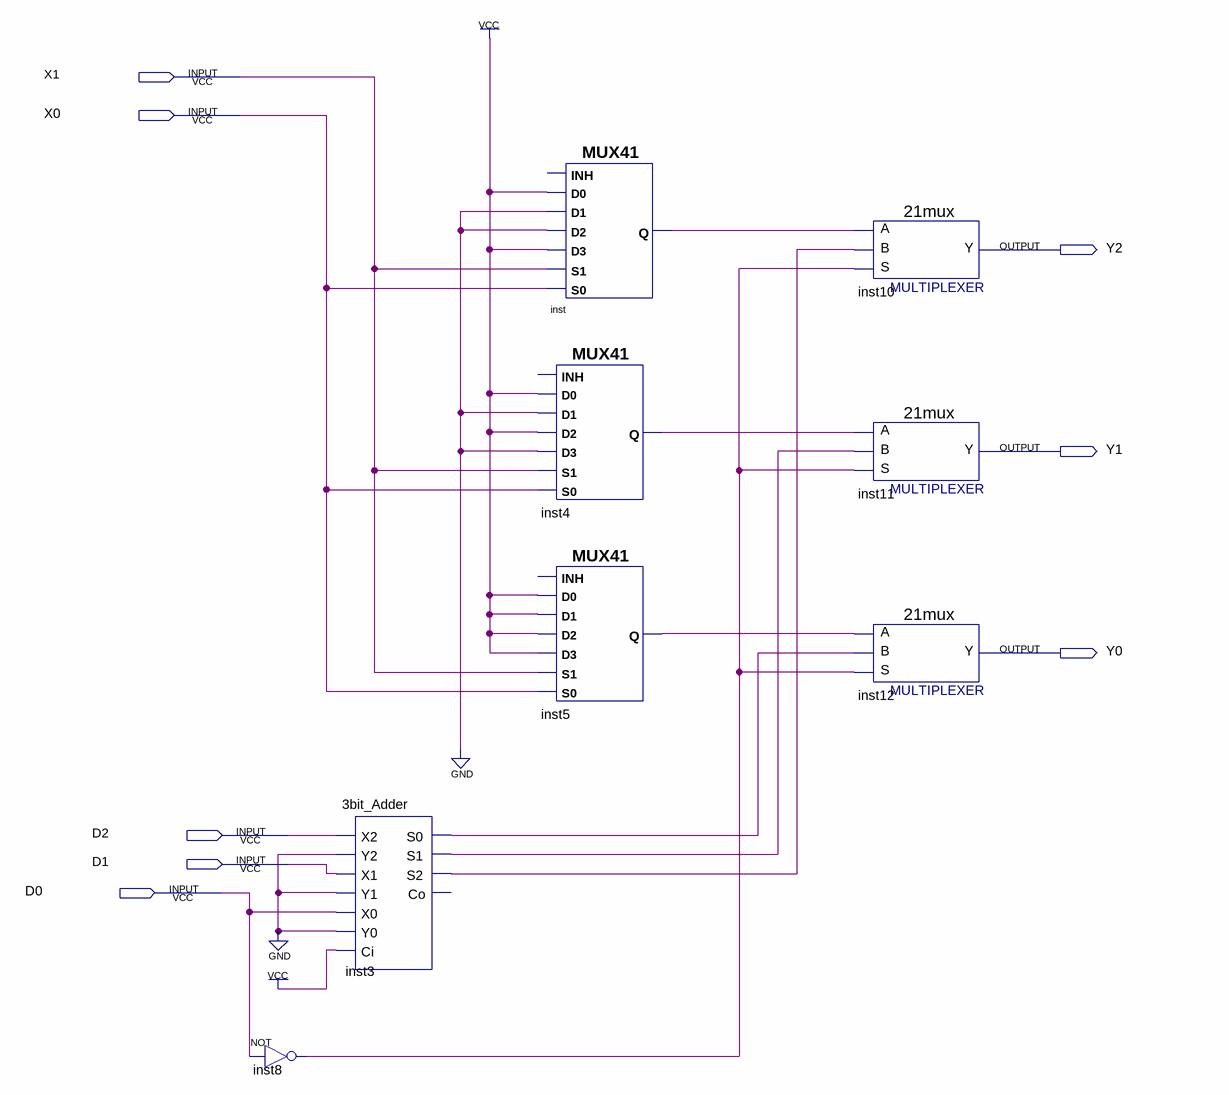
[diagram p0: schematic sheet]
// Quartus schematic nsl.bdf as structural Verilog: 8 symbols, 8 pins
module nsl (
  input  X1,
  input  X0,
  input  D2,
  input  D1,
  input  D0,
  output Y2,
  output Y1,
  output Y0
);

  wire inst3_s0, inst3_s1, inst3_s2, inst4_q, inst5_q, inst8_out, inst_q;

  not inst8 (inst8_out, D0);
  \3bit_Adder  inst3 (
    .X2(D2), .Y2(1'b0), .X1(D1), .Y1(1'b0), .X0(D0), .Y0(1'b0), .Ci(1'b1), .S0(inst3_s0), .S1(inst3_s1),
    .S2(inst3_s2));  // open: Co
  MUX41 inst (.S0(X0), .D2(1'b0), .S1(X1), .D3(1'b1), .D0(1'b1), .D1(1'b0), .Q(inst_q));  // open: INH
  MUX41 inst4 (.S0(X0), .D2(1'b1), .S1(X1), .D3(1'b0), .D0(1'b1), .D1(1'b0), .Q(inst4_q));  // open: INH
  MUX41 inst5 (.S0(X0), .D2(1'b1), .S1(X1), .D3(1'b1), .D0(1'b1), .D1(1'b1), .Q(inst5_q));  // open: INH
  \21mux  inst10 (.S(inst8_out), .B(inst3_s2), .A(inst_q), .Y(Y2));
  \21mux  inst11 (.S(inst8_out), .B(inst3_s1), .A(inst4_q), .Y(Y1));
  \21mux  inst12 (.S(inst8_out), .B(inst3_s0), .A(inst5_q), .Y(Y0));
endmodule
